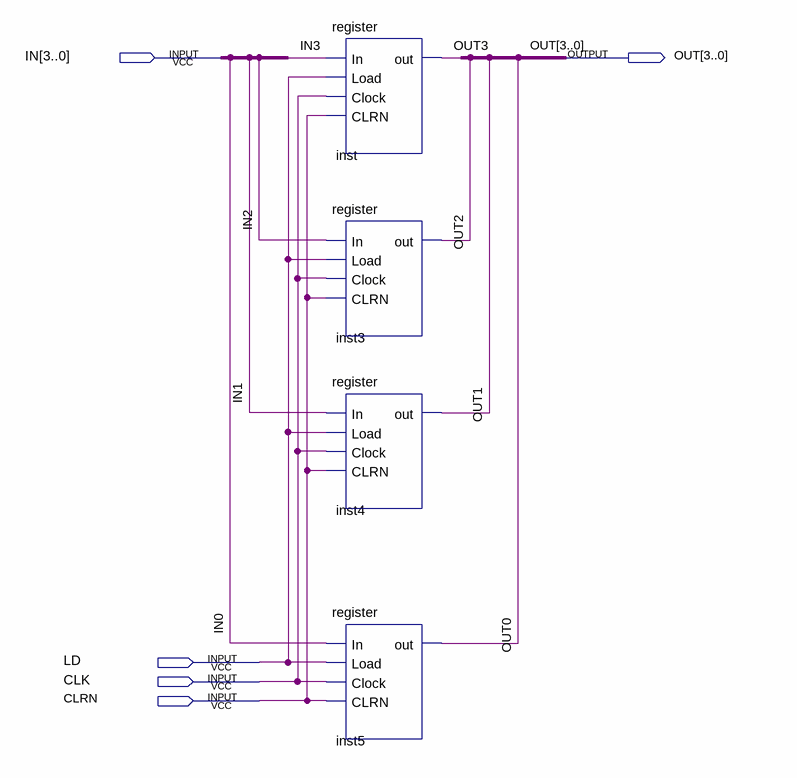
[diagram p0: schematic sheet]
// Quartus schematic reg4b.bdf as structural Verilog: 4 symbols, 5 pins
module reg4b (
  input  [3:0] IN,
  input  LD,
  input  CLK,
  input  CLRN,
  output [3:0] OUT
);

  register inst (.In(IN[3]), .Load(LD), .Clock(CLK), .CLRN(CLRN), .out(OUT[3]));
  register inst3 (.In(IN[2]), .Load(LD), .Clock(CLK), .CLRN(CLRN), .out(OUT[2]));
  register inst4 (.In(IN[1]), .Load(LD), .Clock(CLK), .CLRN(CLRN), .out(OUT[1]));
  register inst5 (.In(IN[0]), .Load(LD), .Clock(CLK), .CLRN(CLRN), .out(OUT[0]));
endmodule
